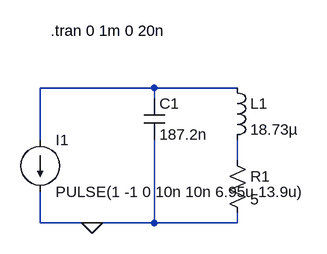
[diagram p0: schematic Draft1.asc]
Draft1.asc, the LTspice schematic file:
Version 4
SHEET 1 880 680
WIRE 416 272 240 272
WIRE 544 272 416 272
WIRE 416 288 416 272
WIRE 240 352 240 272
WIRE 544 384 544 352
WIRE 240 480 240 432
WIRE 320 480 240 480
WIRE 416 480 416 352
WIRE 416 480 320 480
WIRE 544 480 544 464
WIRE 544 480 416 480
FLAG 320 480 0
SYMBOL cap 400 288 R0
SYMATTR InstName C1
SYMATTR Value 187.2n
SYMBOL ind 528 256 R0
SYMATTR InstName L1
SYMATTR Value 18.73µ
SYMBOL res 528 368 R0
SYMATTR InstName R1
SYMATTR Value 5
SYMBOL current 240 352 R0
SYMATTR InstName I1
SYMATTR Value PULSE(1 -1 0 10n 10n 6.95u 13.9u)
TEXT 256 184 Left 2 !.tran 0 1m 0 20n

The netlist it stands for:
* Draft1.asc
C1 N001 0 187.2n
L1 N001 N002 18.73µ
R1 N002 0 5
I1 N001 0 PULSE(1 -1 0 10n 10n 6.95u 13.9u)
.tran 0 1m 0 20n
.backanno
.end